# Altium schematic sheet Low Pass Filter.SchDoc
size A
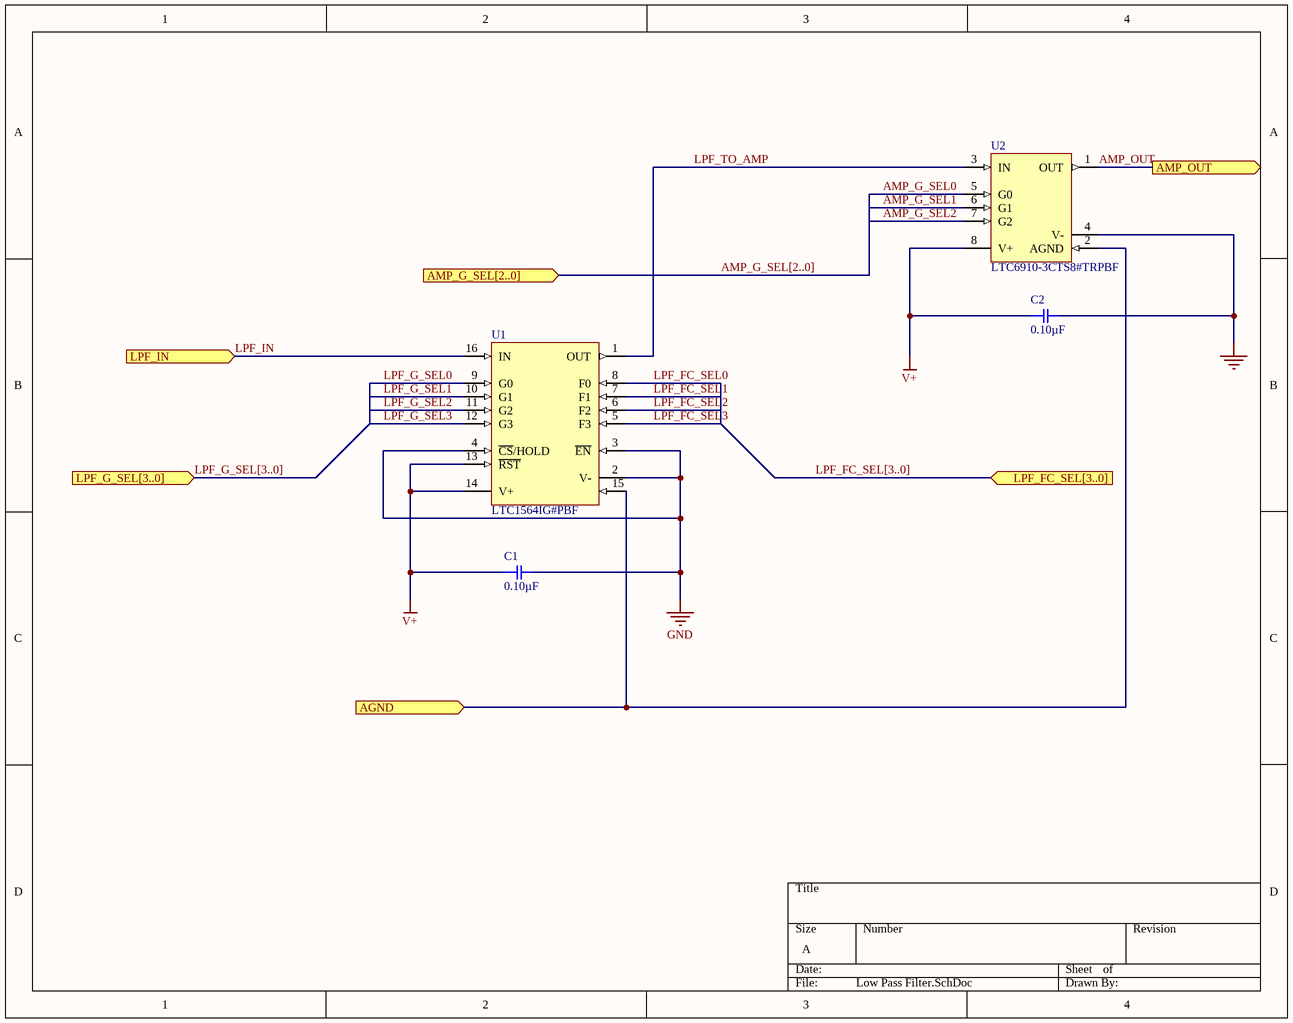
[diagram p0: Low Pass Filter.SchDoc]

## Parts
C1  0.10µF  [SMD-0805C]
C2  0.10µF  [SMD-0805C]
U1  LTC1564IG#PBF  [LT-G-16_M]
U2  LTC6910-3CTS8#TRPBF  [LT-TS8-8-TSOT-23_V]

## Ports
AGND (in), AMP_G_SEL[2..0] (in), AMP_OUT (out), LPF_FC_SEL[3..0] (in), LPF_G_SEL[3..0] (in), LPF_IN (in)

## Nets
GND: C1.2 C2.2 U1.2(V-) U1.3(~{EN}) U1.4(~{CS}/HOLD) U2.4(V-)
V+: C1.1 C2.1 U1.13(~{RST}) U1.14(V+) U2.8(V+)
AGND: U1.15(AGND) U2.2(AGND) ; port AGND
AMP_G_SEL0: U2.5(G0)
AMP_G_SEL1: U2.6(G1)
AMP_G_SEL2: U2.7(G2)
AMP_OUT: U2.1(OUT) ; port AMP_OUT
LPF_FC_SEL0: U1.8(F0)
LPF_FC_SEL1: U1.7(F1)
LPF_FC_SEL2: U1.6(F2)
LPF_FC_SEL3: U1.5(F3)
LPF_G_SEL0: U1.9(G0)
LPF_G_SEL1: U1.10(G1)
LPF_G_SEL2: U1.11(G2)
LPF_G_SEL3: U1.12(G3)
LPF_IN: U1.16(IN) ; port LPF_IN
LPF_TO_AMP: U1.1(OUT) U2.3(IN)

## Buses and harness runs
bus AMP_G_SEL[2..0] = port AMP_G_SEL[2..0]
bus LPF_FC_SEL[3..0] = port LPF_FC_SEL[3..0]
bus LPF_G_SEL[3..0] = port LPF_G_SEL[3..0]

## Library data of the parts
C1 C2 = GCD21BR71H104KA01L: Manufacturer: KEMET; Manufacturer Part Number: C0805C104K3RAC7800; Descriptions: 0.1 µF ±10% 25V Ceramic Capacitor X7R 0805 (2012 Metric); Datasheet Link: https://api.kemet.com/component-edge/download/datasheet/C0805C104K3RACTU.pdf; Value: 0.10µF; Operating Temperature: -55°C ~ 125°C; Package / Case: 0805 (2012 Metric)
U1 = CMP-0359-00059-2: Manufacturer: Analog Devices Inc.; Descriptions: Antialiasing Filter IC Antialiasing 8th Order 150kHz 16-SSOP; RoHS: Pb-Free; Value: N/A; Operating Temperature: -40°C ~ 85°C; Datasheet Link: https://www.analog.com/media/en/technical-documentation/data-sheets/1564fa.pdf; Manufacturer Part Number: LTC1564IG#PBF; Package / Case: 16-SSOP
U2 = CMP-0359-03721-2: Manufacturer: Analog Devices Inc.; Manufacturer Part Number: LTC6910-3CTS8#TRMPBF; Descriptions: Programmable Gain Amplifier 1 Circuit Rail-to-Rail TSOT-23-8; RoHS: Pb-Free; Value: N/A; Operating Temperature: 0°C ~ 70°C; Datasheet Link: https://www.analog.com/media/en/technical-documentation/data-sheets/6910fb.pdf; Package / Case: TSOT-23-8